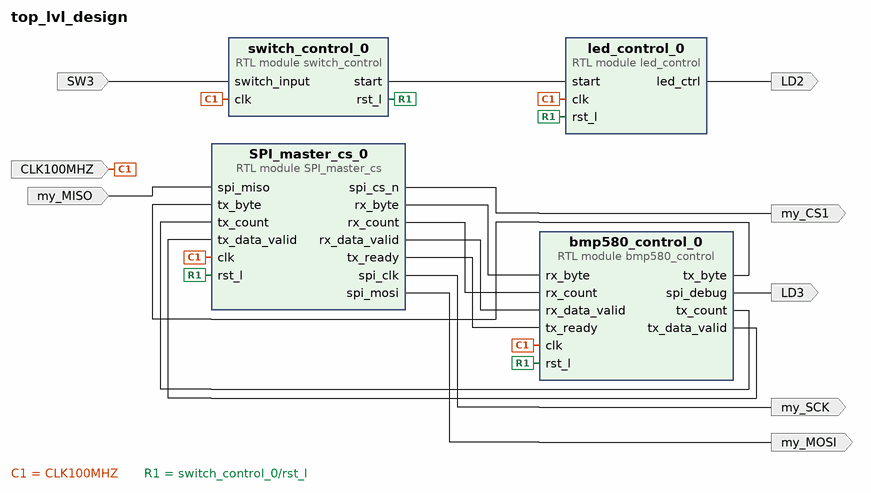
[diagram p0: block diagram of the top level]
# Vivado block design top_lvl_design, xc7s25csga324-1, Vivado 2025.2
create_bd_design top_lvl_design

create_bd_port -dir I SW3
create_bd_port -dir I -type clk CLK100MHZ
set_property -dict {CONFIG.FREQ_HZ 100000000} [get_bd_ports CLK100MHZ]
create_bd_port -dir O LD2
create_bd_port -dir I my_MISO
create_bd_port -dir O my_MOSI
create_bd_port -dir O my_SCK
create_bd_port -dir O LD3
create_bd_port -dir O my_CS1

create_bd_cell -type module -reference led_control led_control_0
create_bd_cell -type module -reference switch_control switch_control_0
create_bd_cell -type module -reference SPI_master_cs SPI_master_cs_0
set_property -dict {CONFIG.CLKS_PER_HALF_BIT 20 CONFIG.MAX_BYTES_PER_CS 16} [get_bd_cells SPI_master_cs_0]
create_bd_cell -type module -reference bmp580_control bmp580_control_0

# ---- connections ----

connect_bd_net [get_bd_ports CLK100MHZ] \
  [get_bd_pins switch_control_0/clk] [get_bd_pins led_control_0/clk] [get_bd_pins SPI_master_cs_0/clk] \
  [get_bd_pins bmp580_control_0/clk]
connect_bd_net [get_bd_pins SPI_master_cs_0/rx_byte] [get_bd_pins bmp580_control_0/rx_byte]
connect_bd_net [get_bd_pins SPI_master_cs_0/rx_count] [get_bd_pins bmp580_control_0/rx_count]
connect_bd_net [get_bd_pins SPI_master_cs_0/rx_data_valid] [get_bd_pins bmp580_control_0/rx_data_valid]
connect_bd_net [get_bd_pins SPI_master_cs_0/spi_clk] [get_bd_ports my_SCK]
connect_bd_net [get_bd_pins SPI_master_cs_0/spi_cs_n] [get_bd_ports my_CS1]
connect_bd_net [get_bd_pins SPI_master_cs_0/spi_mosi] [get_bd_ports my_MOSI]
connect_bd_net [get_bd_pins SPI_master_cs_0/tx_ready] [get_bd_pins bmp580_control_0/tx_ready]
connect_bd_net -net SW3_1 [get_bd_ports SW3] [get_bd_pins switch_control_0/switch_input]
connect_bd_net -net bmp580_control_0_test_ok [get_bd_pins bmp580_control_0/spi_debug] [get_bd_ports LD3]
connect_bd_net [get_bd_pins bmp580_control_0/tx_byte] [get_bd_pins SPI_master_cs_0/tx_byte]
connect_bd_net [get_bd_pins bmp580_control_0/tx_count] [get_bd_pins SPI_master_cs_0/tx_count]
connect_bd_net [get_bd_pins bmp580_control_0/tx_data_valid] [get_bd_pins SPI_master_cs_0/tx_data_valid]
connect_bd_net [get_bd_pins led_control_0/led_ctrl] [get_bd_ports LD2]
connect_bd_net [get_bd_ports my_MISO] [get_bd_pins SPI_master_cs_0/spi_miso]
connect_bd_net [get_bd_pins switch_control_0/rst_l] \
  [get_bd_pins led_control_0/rst_l] [get_bd_pins SPI_master_cs_0/rst_l] [get_bd_pins bmp580_control_0/rst_l]
connect_bd_net [get_bd_pins switch_control_0/start] [get_bd_pins led_control_0/start]

validate_bd_design
save_bd_design
